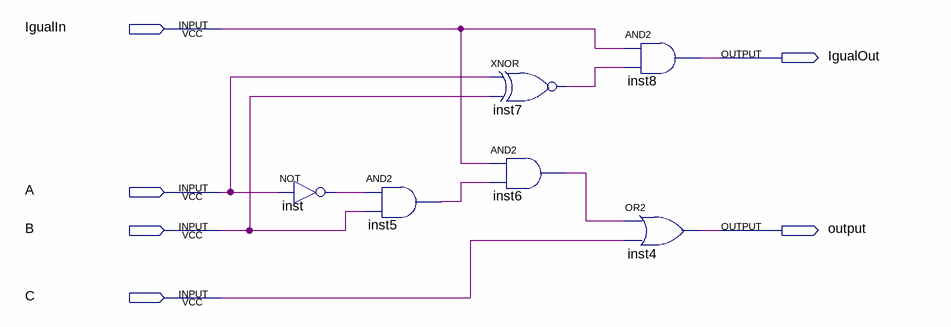
[diagram p0: schematic sheet]
// Quartus schematic CelulaMenor.bdf as structural Verilog: 6 symbols, 6 pins
module CelulaMenor (
  input  IgualIn,
  input  A,
  input  B,
  input  C,
  output IgualOut,
  output \output 
);

  wire inst5_out, inst6_out, inst7_out, inst_out;

  not inst (inst_out, A);
  and inst5 (inst5_out, inst_out, B);
  xnor inst7 (inst7_out, A, B);
  and inst6 (inst6_out, IgualIn, inst5_out);
  and inst8 (IgualOut, IgualIn, inst7_out);
  or inst4 (\output , inst6_out, C);
endmodule
